# Altium project RF_Controller.PrjPcb
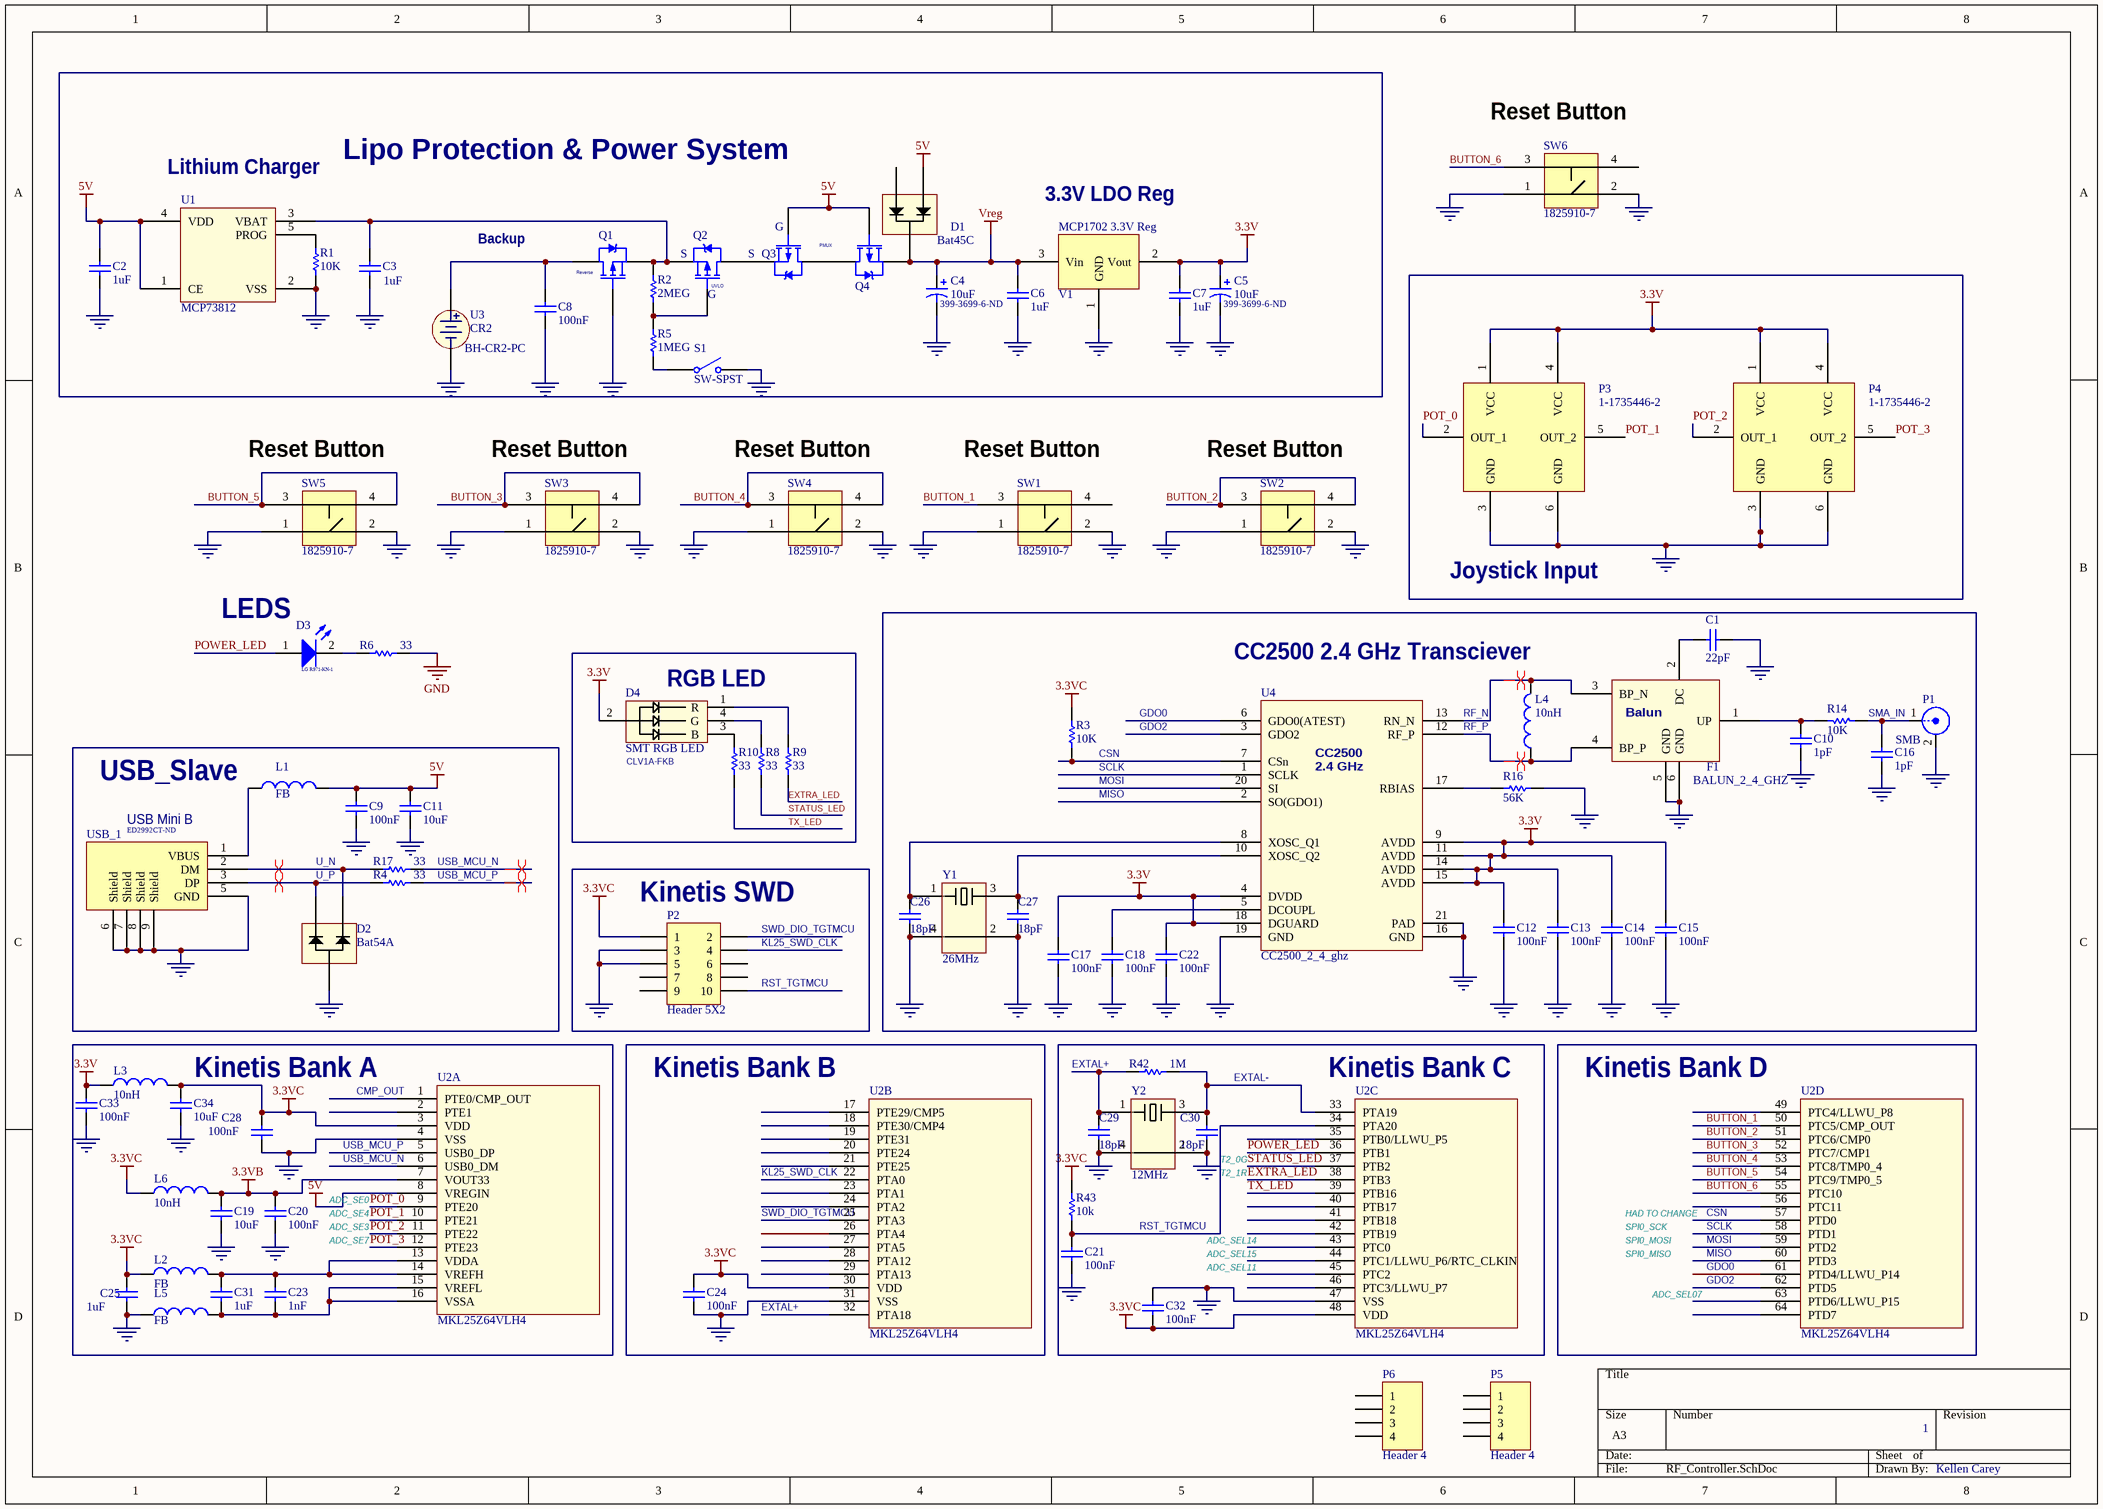
[diagram p0: RF_Controller.SchDoc]
1 sheet, 84 parts. Net scope: global (net labels, ports and power ports of the same name join across sheets).
Board file: RF_Controller.PcbDoc

## Sheet RF_Controller.SchDoc
size A3; DrawnBy: Kellen Carey; Engineer: Nathan Zimmerman and Kellen Carey; Revision: 1; SheetNumber: 1

### Parts
C1  value 22pF  [1608[0603]C]  (hidden comment: 0805)
C2  value 1uF  [1608[0603]C]  (hidden comment: 0805)
C3  value 1uF  [1608[0603]C]  (hidden comment: 0805)
C4  value 10uF  [1206_C]  (hidden comment: Cap Pol1)
C5  value 10uF  [1206_C]  (hidden comment: Cap Pol1)
C6  value 1uF  [1608[0603]C]  (hidden comment: 0805)
C7  value 1uF  [1608[0603]C]  (hidden comment: 0805)
C8  value 100nF  [1608[0603]C]  (hidden comment: 0805)
C9  value 100nF  [1608[0603]C]  (hidden comment: 0805)
C10  value 1pF  [1608[0603]C]  (hidden comment: 0805)
C11  value 10uF  [C0805]  (hidden comment: 0805)
C12  value 100nF  [1608[0603]C]  (hidden comment: 0805)
C13  value 100nF  [1608[0603]C]  (hidden comment: 0805)
C14  value 100nF  [1608[0603]C]  (hidden comment: 0805)
C15  value 100nF  [1608[0603]C]  (hidden comment: 0805)
C16  value 1pF  [1608[0603]C]  (hidden comment: 0805)
C17  value 100nF  [1608[0603]C]  (hidden comment: 0805)
C18  value 100nF  [1608[0603]C]  (hidden comment: 0805)
C19  value 10uF  [C0805]  (hidden comment: 0805)
C20  value 100nF  [1608[0603]C]  (hidden comment: 0805)
C21  value 100nF  [1608[0603]C]  (hidden comment: 0805)
C22  value 100nF  [1608[0603]C]  (hidden comment: 0805)
C23  value 1nF  [1608[0603]C]  (hidden comment: 0805)
C24  value 100nF  [1608[0603]C]  (hidden comment: 0805)
C25  value 1uF  [1608[0603]C]  (hidden comment: 0805)
C26  value 18pF  [1608[0603]C]  (hidden comment: 0805)
C27  value 18pF  [1608[0603]C]  (hidden comment: 0805)
C28  value 100nF  [1608[0603]C]  (hidden comment: 0805)
C29  value 18pF  [1608[0603]C]  (hidden comment: 0805)
C30  value 18pF  [1608[0603]C]  (hidden comment: 0805)
C31  value 1uF  [1608[0603]C]  (hidden comment: 0805)
C32  value 100nF  [1608[0603]C]  (hidden comment: 0805)
C33  value 100nF  [1608[0603]C]  (hidden comment: 0805)
C34  value 10uF  [C0805]  (hidden comment: 0805)
D1  Bat45C  [SOT-23B_N]
D2  Bat54A  [SOT-23B_N]
D3  LG R971-KN-1  [6-0805_M_LED_LIB]
D4  SMT RGB LED  [CLV1A-FKB_RGB_3D]
F1  BALUN_2_4_GHZ  [Balun]
L1  FB  [1608[0603]R]
L2  FB  [1608[0603]R]
L3  10nH  [1608[0603]R]
L4  10nH  [1608[0603]R]
L5  FB  [1608[0603]R]
L6  10nH  [1608[0603]R]
P1  SMB  [SMA]
P2  Header 5X2  [MHDR2X5]
P3  1-1735446-2  [1-1735446-2]
P4  1-1735446-2  [1-1735446-2]
P5  Header 4  [Joystick_Mechanical_Footprint_2]
P6  Header 4  [Joystick_Mechanical_Footprint_2]
Q1  k  [SOT-23_L]  (value not drawn)
Q2  k  [SOT-23_L]  (value not drawn)
Q3  k  [SOT-23_L]  (value not drawn)
Q4  k  [SOT-23_L]  (value not drawn)
R1  value 10K  [1608[0603]R]  (hidden comment: Res1)
R2  value 2MEG  [1608[0603]R]  (hidden comment: Res1)
R3  value 10K  [1608[0603]R]  (hidden comment: Res1)
R4  value 33  [1608[0603]R]  (hidden comment: Res1)
R5  value 1MEG  [1608[0603]R]  (hidden comment: Res1)
R6  value 33  [1608[0603]R]  (hidden comment: Res1)
R8  value 33  [1608[0603]R]  (hidden comment: Res1)
R9  value 33  [1608[0603]R]  (hidden comment: Res1)
R10  value 33  [1608[0603]R]  (hidden comment: Res1)
R14  value 10K  [1608[0603]R]  (hidden comment: Res1)
R16  value 56K  [1608[0603]R]  (hidden comment: Res1)
R17  value 33  [1608[0603]R]  (hidden comment: Res1)
R42  value 1M  [1608[0603]R]  (hidden comment: Res1)
R43  value 10k  [1608[0603]R]  (hidden comment: Res1)
S1  SW-SPST  [418117270901_ft_prt_3d]
SW1  1825910-7  [Tact_ButtonVV]
SW2  1825910-7  [Tact_ButtonVV]
SW3  1825910-7  [Tact_ButtonVV]
SW4  1825910-7  [Tact_ButtonVV]
SW5  1825910-7  [Tact_ButtonVV]
SW6  1825910-7  [Tact_ButtonVV]
U1  MCP73812  [SOT23-5AL]
U2  MKL25Z64VLH4  [TSQFP50P1200X1200-64M]  (parts A,B,C,D of 4)
U3  CR2  [BH-CR2-PC_FTPRT]
U4  CC2500_2_4_ghz  [QFN50P400X400-20VM]
USB_1  Digikey: ED2992CT-ND  [USB_Mini_B_SMT]  (hidden comment: USB-M2xFxx)
V1  MCP1702 3.3V Reg  [SOT-23B_M]
Y1  26MHz  [7M-12.000MAAJ-T_FP]
Y2  12MHz  [7M-12.000MAAJ-T_FP]

### Blocks framed on the sheet
Lipo Protection & Power System: C2-C8 D1 Q1-Q4 R1 R2 R5 S1 U1 U3 V1
Joystick Input: P3 P4
RGB LED: D4 R8-R10
CC2500 2.4 GHz Transciever: C1 C10 C12-C18 C22 C26 C27 F1 L4 P1 R3 R14 R16 U4 Y1
USB_Slave: C9 C11 D2 L1 R4 R17 USB_1
Kinetis SWD: P2
Kinetis Bank A: C19 C20 C23 C25 C28 C31 C33 C34 L2 L3 L5 L6 U2
Kinetis Bank B: C24 U2
Kinetis Bank C: C21 C29 C30 C32 R42 R43 U2 Y2
Kinetis Bank D: U2

### Nets
3.3V: C5.1 C7.1 C12.1 C13.1 C14.1 C15.1 C17.1 C22.1 C33.1 D4.2(V+) L3.2 P3.1(VCC) P3.4(VCC) P4.1(VCC) P4.4(VCC) U4.4(DVDD) U4.9(AVDD) U4.11(AVDD) U4.14(AVDD) U4.15(AVDD) U4.18(DGUARD) V1.2(Vout)
3.3VB: C19.1 C20.1 L6.1 U2.7(VOUT33)
3.3VC: C24.2 C25.2 C28.2 C32.1 C34.1 L2.2 L3.1 L6.2 P2.1 R3.2 R43.2 U2.3(VDD) U2.30(VDD) U2.48(VDD)
5V: C2.1 C9.1 C11.1 D1.1 L1.1 Q3.1(G) Q4.1(G) U1.1(CE) U1.4(VDD) U2.8(VREGIN)
GND: C1.2 C2.2 C3.2 C4.2 C5.2 C6.2 C7.2 C8.2 C9.2 C10.1 C11.2 C12.2 C13.2 C14.2 C15.2 C16.1 C17.2 C18.2 C19.2 C20.2 C21.1 C22.2 C24.1 C25.1 C26.1 C27.1 C28.1 C29.1 C30.1 C32.2 C33.2 C34.2 D2.3 F1.5(GND) F1.6(GND) L5.2 P1.2(Y) P2.3 P2.5 P3.3(GND) P3.6(GND) P4.3(GND) P4.6(GND) Q1.1(G) R1.2 R6.2 R16.2 S1.2(NO) SW1.1 SW1.2 SW2.1 SW2.2 SW3.1 SW3.2 SW4.1 SW4.2 SW5.1 SW5.2 SW6.1 SW6.2 U1.2(VSS) U2.4(VSS) U2.31(VSS) U2.47(VSS) U3.1(-) U4.16(GND) U4.19(GND) U4.21(PAD) USB_1.5(GND) USB_1.6(Shield) USB_1.7(Shield) USB_1.8(Shield) USB_1.9(Shield) V1.1(GND) Y1.2(GND) Y1.4(GND) Y2.2(GND) Y2.4(GND)
Vreg: C4.1 C6.1 D1.3 Q4.2(S) V1.3(Vin)
BUTTON_1: SW1.3 U2.50(PTC5/CMP_OUT)
BUTTON_2: SW2.3 SW2.4 U2.51(PTC6/CMP0)
BUTTON_3: SW3.3 SW3.4 U2.52(PTC7/CMP1)
BUTTON_4: SW4.3 SW4.4 U2.53(PTC8/TMP0_4)
BUTTON_5: SW5.3 SW5.4 U2.54(PTC9/TMP0_5)
BUTTON_6: SW6.3 U2.55(PTC10)
CMP_OUT: U2.1(PTE0/CMP_OUT)
CSN: R3.1 U2.57(PTD0) U4.7(CSn)
EXTAL+: C29.2 R42.1 U2.32(PTA18) Y2.1(X1)
EXTAL-: C30.2 R42.2 U2.33(PTA19) Y2.3(X2)
EXTRA_LED: R9.1 U2.38(PTB3)
GDO0: U2.61(PTD4/LLWU_P14) U4.6(GDO0(ATEST))
GDO2: U2.62(PTD5) U4.3(GDO2)
KL25_SWD_CLK: P2.4 U2.22(PTA0)
MISO: U2.60(PTD3) U4.2(SO(GDO1))
MOSI: U2.59(PTD2) U4.20(SI)
POT_0: P3.2(OUT_1) U2.9(PTE20)
POT_1: P3.5(OUT_2) U2.10(PTE21)
POT_2: P4.2(OUT_1) U2.11(PTE22)
POT_3: P4.5(OUT_2) U2.12(PTE23)
POWER_LED: D3.1(A) U2.36(PTB1)
RF_N: F1.3(BP_N) L4.1 U4.13(RN_N)
RF_P: F1.4(BP_P) L4.2 U4.12(RF_P)
RST_TGTMCU: C21.2 P2.10 R43.1 U2.34(PTA20)
SCLK: U2.58(PTD1) U4.1(SCLK)
SMA_IN: C16.2 P1.1(X) R14.1
STATUS_LED: R8.1 U2.37(PTB2)
SWD_DIO_TGTMCU: P2.2 U2.25(PTA3)
TX_LED: R10.1 U2.39(PTB16)
U_N: D2.1 R17.1 USB_1.2(DM)
U_P: D2.2 R4.1 USB_1.3(DP)
USB_MCU_N: R17.2 U2.6(USB0_DM)
USB_MCU_P: R4.2 U2.5(USB0_DP)
NetC1_1: C1.1 F1.2(DC)
NetC3_1: C3.1 Q1.2(S) Q2.2(S) R2.2 U1.3(VBAT)
NetC8_1: C8.1 Q1.3(D) U3.2(+)
NetC10_2: C10.2 F1.1(UP) R14.2
NetC18_1: C18.1 U4.5(DCOUPL)
NetC23_1: C23.1 C31.1 L5.1 U2.15(VREFL) U2.16(VSSA)
NetC23_2: C23.2 C31.2 L2.1 U2.13(VDDA) U2.14(VREFH)
NetC26_2: C26.2 U4.8(XOSC_Q1) Y1.1(X1)
NetC27_2: C27.2 U4.10(XOSC_Q2) Y1.3(X2)
NetD3_2: D3.2(K) R6.1
NetD4_1: D4.1(R) R9.2
NetD4_3: D4.3(B) R10.2
NetD4_4: D4.4(G) R8.2
NetL1_2: L1.2 USB_1.1(VBUS)
NetQ2_1: Q2.1(G) R2.1 R5.2
NetQ2_3: Q2.3(D) Q3.2(S)
NetQ3_3: Q3.3(D) Q4.3(D)
NetR1_1: R1.1 U1.5(PROG)
NetR5_1: R5.1 S1.1(COMMON)
NetR16_1: R16.1 U4.17(RBIAS)

Not connected (* = marked no-connect by the designer): D1 2(0); P2 6 7 8 9; P5 1 2 3 4; P6 1 2 3 4; SW1 4; SW6 4; U2 2(PTE1) 17(PTE29/CMP5) 18(PTE30/CMP4) 19(PTE31) 20(PTE24) 21(PTE25) 23(PTA1) 24(PTA2) 26(PTA4) 27(PTA5) 28(PTA12) 29(PTA13) 35(PTB0/LLWU_P5) 40(PTB17) 41(PTB18) 42(PTB19) 43(PTC0) 44(PTC1/LLWU_P6/RTC_CLKIN) 45(PTC2) 46(PTC3/LLWU_P7) 49(PTC4/LLWU_P8) 56(PTC11) 63(PTD6/LLWU_P15) 64(PTD7); USB_1 4(NC)

### Layout directives
differential pair: RF_N, RF_P, U_N, U_P, USB_MCU_N, USB_MCU_P

### Notes on the sheet
- (near U1) Lithium Charger
- (near SW6) Reset Button
- Backup
- (near Q3) G
- PMUX
- 3.3V LDO Reg
- (near Q1) Reverse
- (near Q2) S
- (near Q2) G
- (near Q2) UVLO
- S
- (near SW5) Reset Button
- (near SW3) Reset Button
- (near SW4) Reset Button
- (near SW1) Reset Button
- (near SW2) Reset Button
- (near D3) LEDS
- (near USB_1) USB Mini B
- (near C30) T2_0
- (near C30) T2_1
- (near C30) R
- (near C30) G
- ADC_SE0
- ADC_SE3
- ADC_SE4
- ADC_SE7
- ADC_SEL14
- ADC_SEL15
- SPI0_MISO
- SPI0_MOSI
- SPI0_SCK
- HAD TO CHANGE
- ADC_SEL11
- ADC_SEL07
- 1
- Kellen Carey
- (in symbol BALUN_2_4_GHZ) Balun
- (in symbol Cap Pol1) 399-3699-6-ND
- (in symbol CC2500_2_4_ghz) CC2500; 2.4 GHz
- (in symbol CR2) BH-CR2-PC
- (in symbol RGB_LED_SMT) CLV1A-FKB

### Library data of the parts
C1-C3 C6-C25 C28-C34 = Cap Semi: Capacitor (Semiconductor SIM Model); Published: 8-Jun-2000; LatestRevisionDate: 29-May-2009; LatestRevisionNote: IPC-7351 Footprint Added.; PackageReference: C1206; Publisher: Altium Limited; PackageDescription: Chip Capacitor; Digikey: 311-1361-1-ND
C4 C5 = Cap Pol1: Polarized Capacitor (Radial)
C26 C27 = Cap Semi: Capacitor (Semiconductor SIM Model); Part_Number: CL10C180JC8NNNC; PackageDescription: Chip Capacitor
D2 = Bat45C
D3 = LED3: PP1: 0.08000; PP100: 0.05480
D4 = RGB_LED_SMT
F1 = BALUN_2_4_GHZ: 2450BM15B0003; Part Number: 2450BM15B0003
L1-L6 = Inductor
P1 = SMB: SMB Straight Connector; Part #: 5-1814832-1
P2 = Header 5X2: Header, 5-Pin, Dual row; LatestRevisionDate: 17-Jul-2002; LatestRevisionNote: Re-released for DXP Platform.; Publisher: Altium Limited
P3 P4 = TE_CONN: TE Connectivity AMP Connector
P5 P6 = Header 4: Header, 4-Pin; LatestRevisionDate: 17-Jul-2002; LatestRevisionNote: Re-released for DXP Platform.; Publisher: Altium Limited
Q1-Q4 = PMOS-2: P-Channel Power MOSFET
R1-R6 R8-R10 R14 R16 R17 R42 R43 = Res1: Resistor; Published: 8-Jun-2000; LatestRevisionDate: 17-Jul-2002; LatestRevisionNote: Re-released for DXP Platform.; PackageReference: AXIAL-0.3; Publisher: Altium Limited; PackageDescription: Axial Device, Thru-Hole; 2 Leads; 0.3 in Pin Spacing
S1 = SW-SPST: Single-Pole, Single-Throw Switch; Part #: 418117270901
SW1-SW6 = D6x-XX: PP1: 0.1; PP100: 0.0470
U2 = MKL25Z64VLH4: MKL25Z64VLH4 MCU
USB_1 = USB-M2xFxx: USB Mini-B for USB-M2xFxx
V1 = MCP1700: MCP1700 3.3V REG
Y1 Y2 = 12MHz_Crystal: 12MHz Micro Crystal